# Altium schematic sheet [2] - BLOCK DIAGRAM.SchDoc: BLOCK DIAGRAM
size B; Organization: Altium Limited; Address1: L3, 12a Rodborough Rd; Address2: Frenchs Forest; Address3: NSW; Address4: Australia 2086; DocumentNumber: 2; Revision: V1I1; SheetNumber: 2; SheetTotal: 16
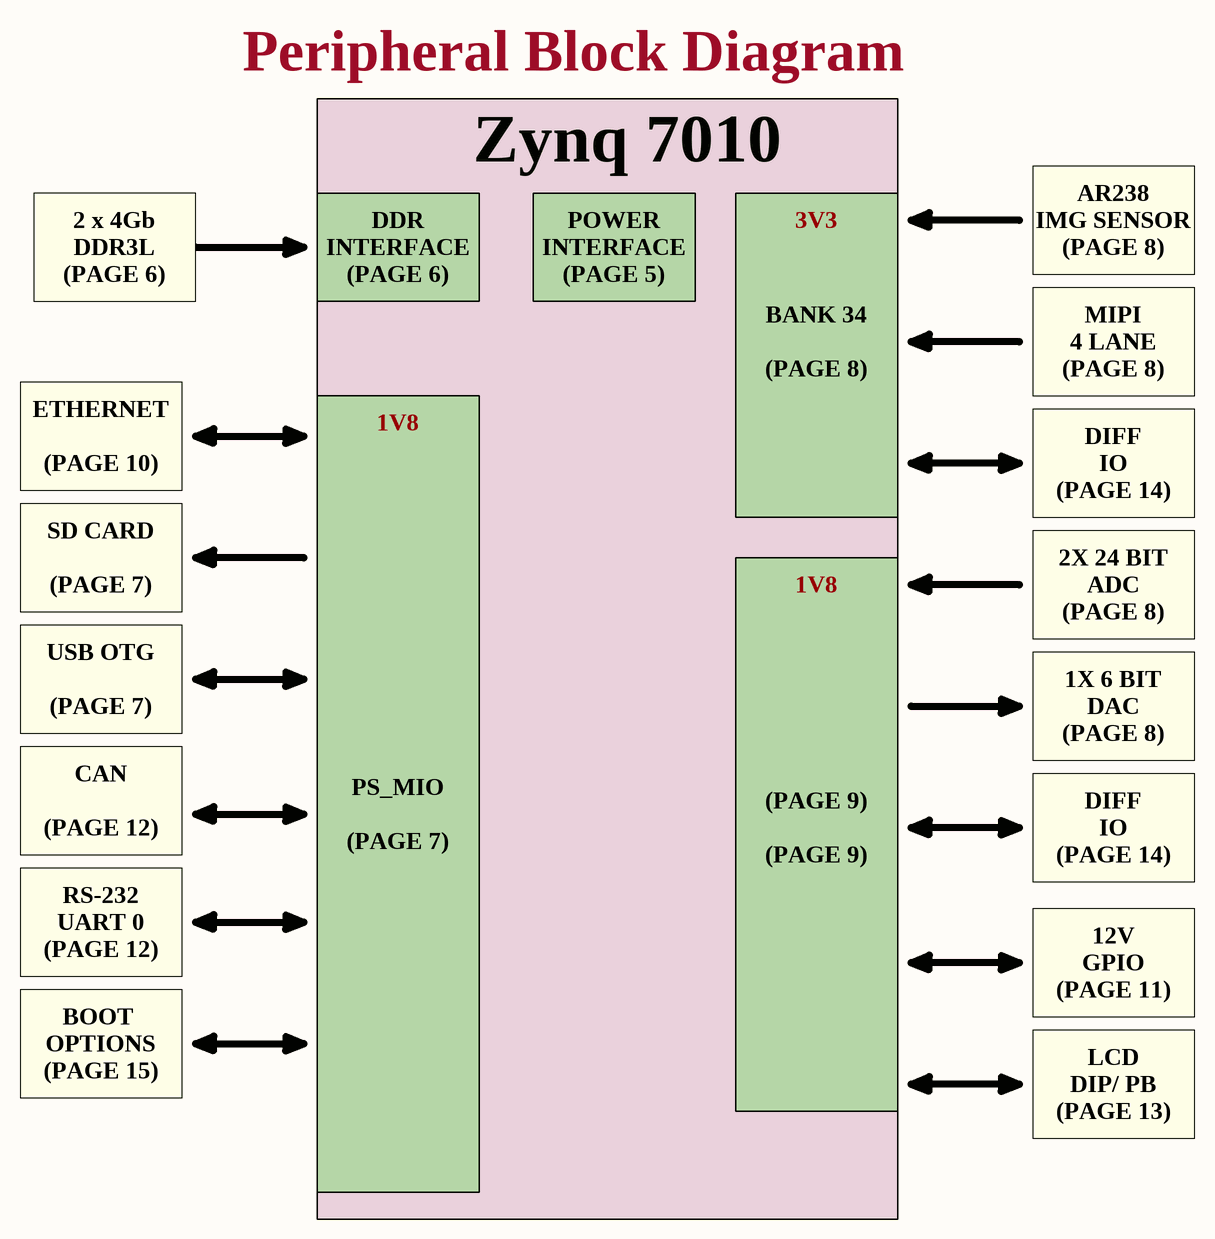
[diagram p0: [2] - BLOCK DIAGRAM.SchDoc]

## Notes on the sheet
- Peripheral Block Diagram
- Zynq 7010
- AR238
- 2 x 4Gb
- DDR3L
- (PAGE 6)
- INTERFACE
- DDR
- POWER
- (PAGE 5)
- 3V3
- (PAGE 8)
- IMG SENSOR
- BANK 34
- MIPI
- 4 LANE
- ETHERNET
- (PAGE 10)
- 1V8
- DIFF
- IO
- SD CARD
- (PAGE 14)
- (PAGE 7)
- 2X 24 BIT
- ADC
- USB OTG
- 1X 6 BIT
- DAC
- CAN
- PS_MIO
- (PAGE 9)
- (PAGE 12)
- RS-232
- UART 0
- 12V
- BOOT
- (PAGE 11)
- GPIO
- (PAGE 15)
- OPTIONS
- LCD
- DIP/ PB
- (PAGE 13)
- Title
- Size:
- Date:
- B
- Number:
- Time:
- Revision:
- Sheet
- of
- Mathew Locoteta
- 85 Artist Lake Dr.
- Middle Island
- New York, 11953
- United States of America
- File: